# Altium schematic sheet INPUT AND OUPUT.SchDoc
size A
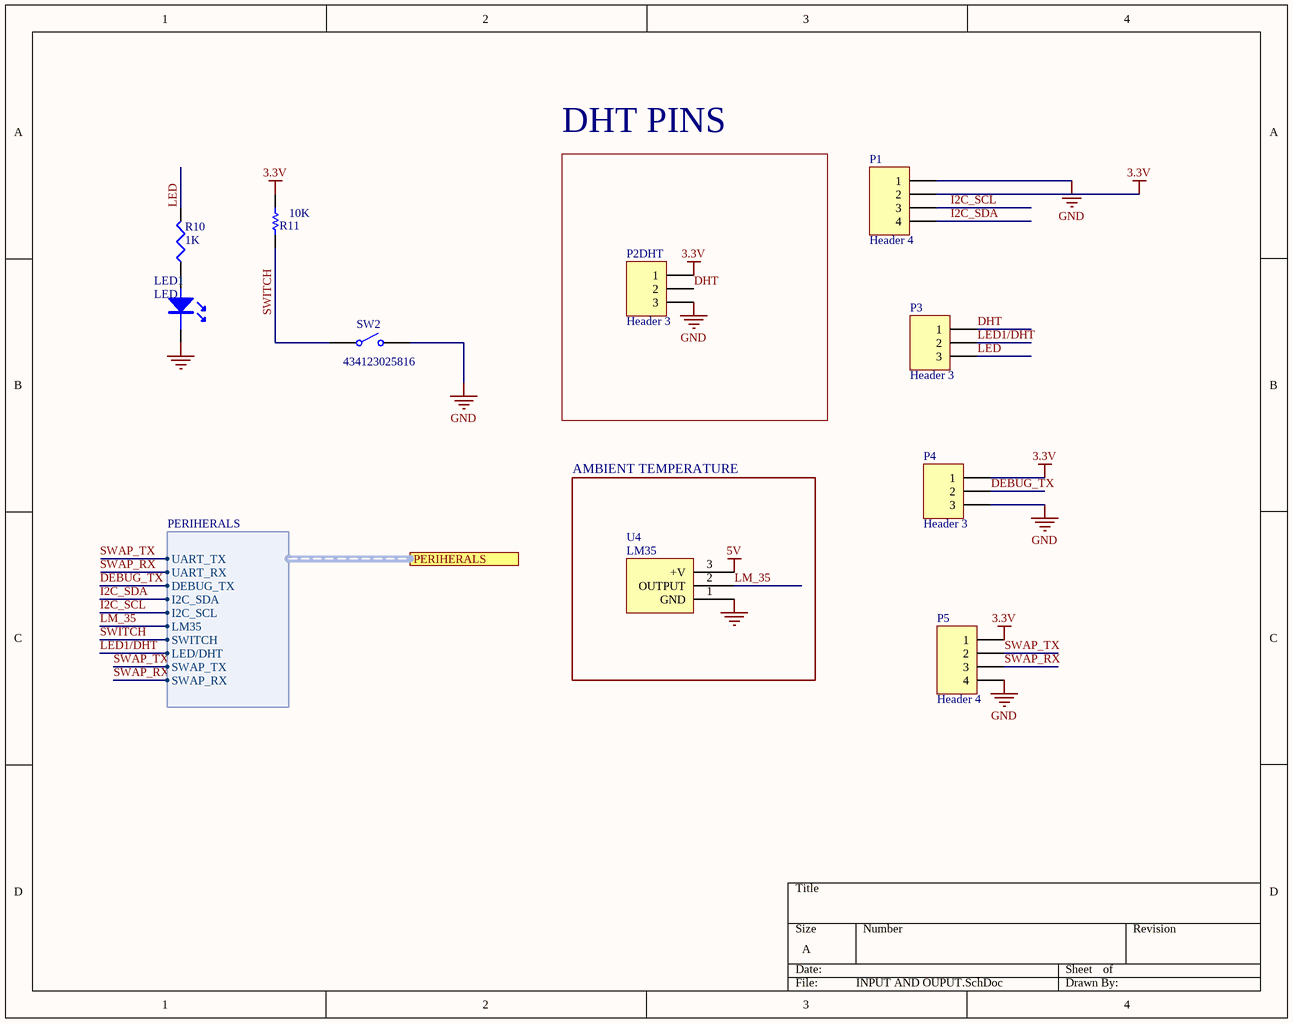
[diagram p0: INPUT AND OUPUT.SchDoc]

## Parts
LED1  LED  [Type 3mm]
P1  Header 4  [HDR1X4]
P2DHT  Header 3  [HDR1X3]
P3  Header 3  [HDR1X3]
P4  Header 3  [HDR1X3]
P5  Header 4  [HDR1X4]
R10  1K  [RESC0603]
R11  10K  [RESC0603]
SW2  434123025816  [434123025816]
U4  LM35  [TO92S]

## Blocks framed on the sheet
DHT PINS: P2DHT
AMBIENT TEMPERATURE: U4

## Ports
PERIHERALS (harness PERIHERALS)

## Harnesses
PERIHERALS: UART_TX, UART_RX, DEBUG_TX, I2C_SDA, I2C_SCL, LM35, SWITCH, LED/DHT, SWAP_TX, SWAP_RX

## Nets
3.3V: P1.2 P2DHT.1 P4.1 P5.1 R11.2
5V: U4.3(+V)
GND: LED1.1(A) P1.1 P2DHT.3 P4.3 P5.4 SW2.2 U4.1(GND)
DEBUG_TX: P4.2 ; port PERIHERALS.DEBUG_TX
DHT: P2DHT.2 P3.1
I2C_SCL: P1.3 ; port PERIHERALS.I2C_SCL
I2C_SDA: P1.4 ; port PERIHERALS.I2C_SDA
LED: P3.3 R10.2
LED1/DHT: P3.2 ; port PERIHERALS.LED/DHT
LM_35: U4.2(OUTPUT) ; port PERIHERALS.LM35
SWAP_RX: P5.3 ; port PERIHERALS.SWAP_RX
SWAP_TX: P5.2 ; port PERIHERALS.SWAP_TX
SWITCH: R11.1 SW2.1 ; port PERIHERALS.SWITCH
NetLED1_2: LED1.2(K) R10.1

## Notes on the sheet
- Labels drawn without touching a wire or pin: SWAP_RX, SWAP_TX

## Library data of the parts
P1 P5 = Header 4: Header, 4-Pin; LatestRevisionDate: 17-Jul-2002; LatestRevisionNote: Re-released for DXP Platform.; Publisher: Altium Limited
P2DHT P3 P4 = Header 3: Header, 3-Pin; LatestRevisionDate: 17-Jul-2002; LatestRevisionNote: Re-released for DXP Platform.; Publisher: Altium Limited
R10 = RES1: RESISTOR
R11 = CMP-1013-00215-1: 2R55 0.125W 1% 0805 (2012 Metric)  SMD; Case-Metric: 2012; Value: 2.55 Ohm; Case-EIA: 0805; Tolerance: 1 %; Technology: SMT; Power: 0.125 W
SW2 = CMP-1460-00004-1: WS-TASV J-Bend SMD Tact Switch 6.0X3.8 mm; Manufacturer: Wuerth Elektronik; NoPins: 02; ComponentLink2Description: Datasheet; ComponentLink2URL: http://katalog.we-online.de/em/datasheet/434123025816.pdf; ComponentLink1URL: http://www.we-online.com; PartNumber: 434123025816; PackageReference: 434123025816; ComponentLink1Description: Manufacturer URL